# EAGLE design cardV3 (EAGLE 7.7.0)
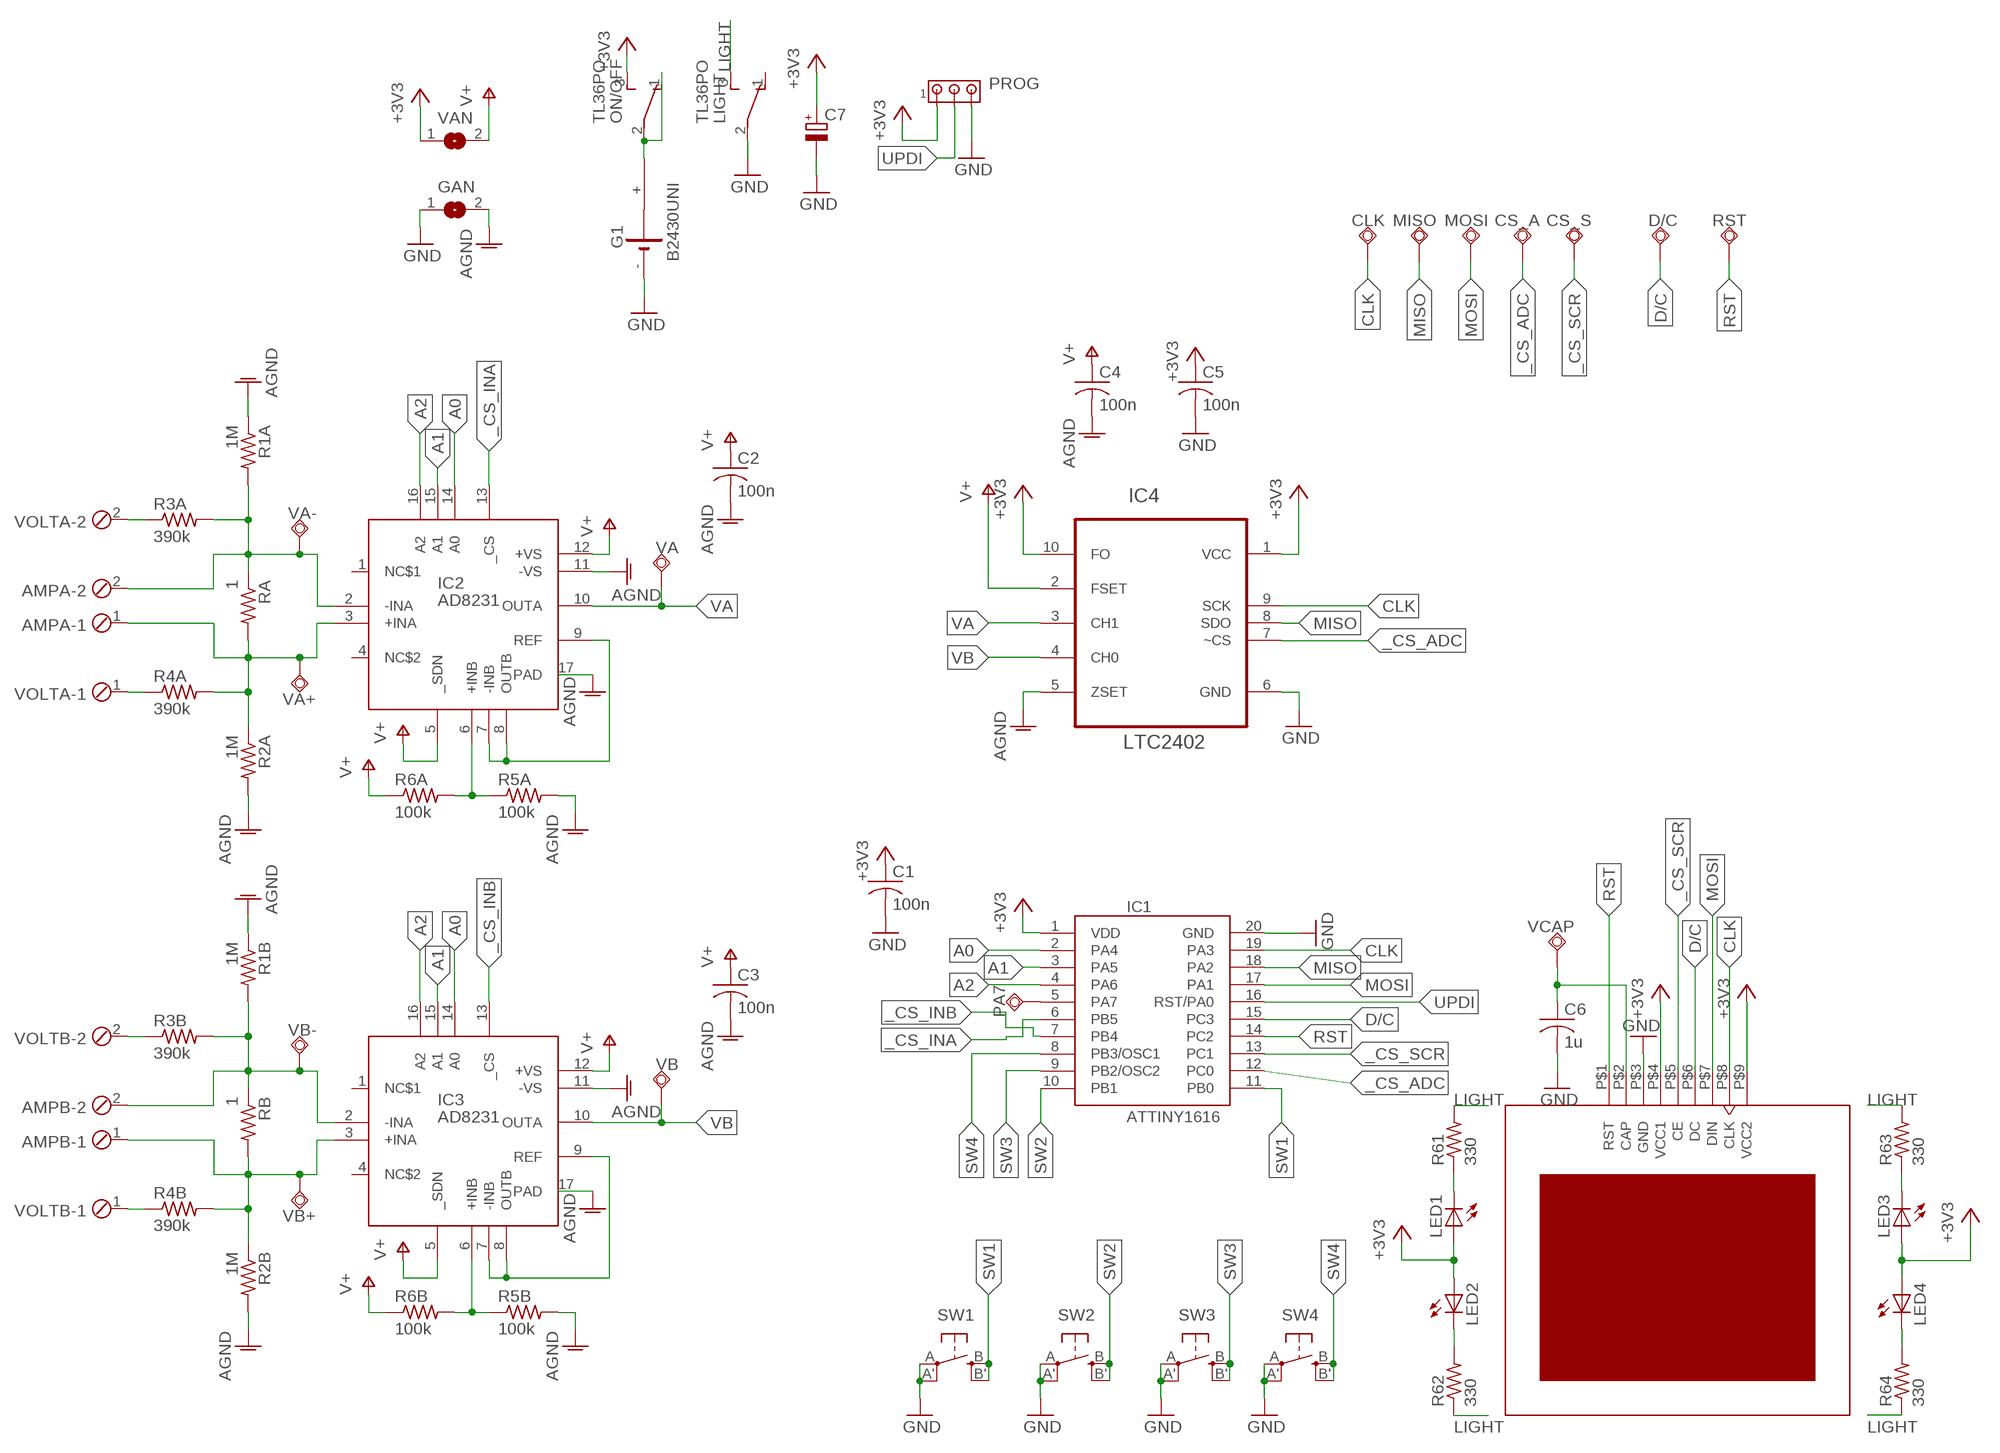
[diagram p0: schematic, sheet 1]

## Parts
AMPA  MPT2  [2POL254]
AMPB  MPT2  [2POL254]
C1  100n  C-USC0805K  [C0805K]
C2  100n  C-USC0805K  [C0805K]
C3  100n  C-USC0805K  [C0805K]
C4  100n  C-USC0805K  [C0805K]
C5  100n  C-USC0805K  [C0805K]
C6  1u  C-USC0805  [C0805]
C7  CPOL-EU153CLV-0405  [153CLV-0405]
CLK  TPSQB1,27  [B1,27]
CS_A  TPSQB1,27  [B1,27]
CS_S  TPSQB1,27  [B1,27]
D/C  TPSQB1,27  [B1,27]
G1  B2430UNI  [B2430UNI]
GAN  SJ  [SJ]
IC1  ATTINY1616  [SO20W]
IC2  AD8231  [LFCSP16]
IC3  AD8231  [LFCSP16]
IC4  LTC2402  LTC2402CMS  [MSOP10]
LED1  LEDCHIP-LED0805  [CHIP-LED0805]
LED2  LEDCHIP-LED0805  [CHIP-LED0805]
LED3  LEDCHIP-LED0805  [CHIP-LED0805]
LED4  LEDCHIP-LED0805  [CHIP-LED0805]
LIGHT  TL36PO  [TL3XPO]
MISO  TPSQB1,27  [B1,27]
MOSI  TPSQB1,27  [B1,27]
ON/OFF  TL36PO  [TL3XPO]
PA7  TPSQB1,27  [B1,27]
PROG  MTA03-100  [10X03MTA]
R1A  1M  R-US_M0805  [M0805]
R1B  1M  R-US_M0805  [M0805]
R2A  1M  R-US_M0805  [M0805]
R2B  1M  R-US_M0805  [M0805]
R3A  390k  R-US_M0805  [M0805]
R3B  390k  R-US_M0805  [M0805]
R4A  390k  R-US_M0805  [M0805]
R4B  390k  R-US_M0805  [M0805]
R5A  100k  R-US_M0805  [M0805]
R5B  100k  R-US_M0805  [M0805]
R6A  100k  R-US_M0805  [M0805]
R6B  100k  R-US_M0805  [M0805]
R61  330  R-US_M0805  [M0805]
R62  330  R-US_M0805  [M0805]
R63  330  R-US_M0805  [M0805]
R64  330  R-US_M0805  [M0805]
RA  1  R-US_M0805  [M0805]
RB  1  R-US_M0805  [M0805]
RST  TPSQB1,27  [B1,27]
SCR  NOKIA_SCREEN  [NOKIA_SCREEN]
SW1  SPST_TACT-EVQQ2  [EVQ-Q2]
SW2  SPST_TACT-EVQQ2  [EVQ-Q2]
SW3  SPST_TACT-EVQQ2  [EVQ-Q2]
SW4  SPST_TACT-EVQQ2  [EVQ-Q2]
VA  TPSQB1,27  [B1,27]
VA+  TPSQB1,27  [B1,27]
VA-  TPSQB1,27  [B1,27]
VAN  SJ  [SJ]
VB  TPSQB1,27  [B1,27]
VB+  TPSQB1,27  [B1,27]
VB-  TPSQB1,27  [B1,27]
VCAP  TPSQB1,27  [B1,27]
VOLTA  MPT2  [2POL254]
VOLTB  MPT2  [2POL254]

## Nets
+3V3: C1.1 C5.1 C7.+ IC1.1(VDD) IC4.1(VCC) IC4.10(FO) LED1.A LED2.A LED3.A LED4.A ON/OFF.3(S) PROG.1 SCR.P$4(VCC1) SCR.P$9(VCC2) VAN.1
_CS_ADC: CS_A.TP IC1.12(PC0) IC4.7(~CS)
_CS_INA: IC1.6(PB5) IC2.13(_CS)
_CS_INB: IC1.7(PB4) IC3.13(_CS)
_CS_SCR: CS_S.TP IC1.13(PC1) SCR.P$5(CE)
A0: IC1.2(PA4) IC2.14(A0) IC3.14(A0)
A1: IC1.3(PA5) IC2.15(A1) IC3.15(A1)
A2: IC1.4(PA6) IC2.16(A2) IC3.16(A2)
AGND: C2.2 C3.2 C4.2 GAN.2 IC2.11(-VS) IC2.17(PAD) IC3.11(-VS) IC3.17(PAD) IC4.5(ZSET) R1A.1 R1B.1 R2A.2 R2B.2 R5A.2 R5B.2
CLK: CLK.TP IC1.19(PA3) IC4.9(SCK) SCR.P$8(CLK)
D/C: D/C.TP IC1.15(PC3) SCR.P$6(DC)
GND: C1.2 C5.2 C6.2 C7.- G1.- GAN.1 IC1.20(GND) IC4.6(GND) LIGHT.2(P) PROG.3 SCR.P$3(GND) SW1.A'(P1) SW1.A(P) SW2.A'(P1) SW2.A(P) SW3.A'(P1) SW3.A(P) SW4.A'(P1) SW4.A(P)
LIGHT: LIGHT.3(S) R61.2 R62.1 R63.2 R64.1
MISO: IC1.18(PA2) IC4.8(SDO) MISO.TP
MOSI: IC1.17(PA1) MOSI.TP SCR.P$7(DIN)
N$1: G1.+ ON/OFF.1(O) ON/OFF.2(P)
N$2: LED1.C R61.1
N$3: C6.1 SCR.P$2(CAP) VCAP.TP
N$4: LED2.C R62.2
N$5: LED4.C R64.2
N$6: LED3.C R63.1
N$7: R4A.1 VOLTA.1
N$8: AMPB.2 IC3.2(-INA) R1B.2 R3B.2 RB.1 VB-.TP
N$9: AMPB.1 IC3.3(+INA) R2B.1 R4B.2 RB.2 VB+.TP
N$10: IC2.6(+INB) R5A.1 R6A.2
N$11: R3A.1 VOLTA.2
N$12: AMPA.2 IC2.2(-INA) R1A.2 R3A.2 RA.1 VA-.TP
N$13: IC2.7(-INB) IC2.8(OUTB) IC2.9(REF)
N$14: AMPA.1 IC2.3(+INA) R2A.1 R4A.2 RA.2 VA+.TP
N$15: R3B.1 VOLTB.2
N$16: IC3.7(-INB) IC3.8(OUTB) IC3.9(REF)
N$17: R4B.1 VOLTB.1
N$18: IC3.6(+INB) R5B.1 R6B.2
N$19: IC1.5(PA7) PA7.TP
RST: IC1.14(PC2) RST.TP SCR.P$1(RST)
SW1: IC1.11(PB0) SW1.B'(S1) SW1.B(S)
SW2: IC1.10(PB1) SW2.B'(S1) SW2.B(S)
SW3: IC1.9(PB2/OSC2) SW3.B'(S1) SW3.B(S)
SW4: IC1.8(PB3/OSC1) SW4.B'(S1) SW4.B(S)
UPDI: IC1.16(RST/PA0) PROG.2
V+: C2.1 C3.1 C4.1 IC2.5(_SDN) IC2.12(+VS) IC3.5(_SDN) IC3.12(+VS) IC4.2(FSET) R6A.1 R6B.1 VAN.2
VA: IC2.10(OUTA) IC4.3(CH1) VA.TP
VB: IC3.10(OUTA) IC4.4(CH0) VB.TP
Unconnected: G1.+@1(+) G1.+@2(+) G1.+@3(+) G1.+@4(+) G1.-@1(-) IC2.1(NC$1) IC2.4(NC$2) IC3.1(NC$1) IC3.4(NC$2) LIGHT.1(O)

## Library data of the parts
AMPA AMPB VOLTA VOLTB = con-phoenix-254:MPT2: PHOENIX CONNECTOR; OC_FARNELL: unknown; OC_NEWARK: unknown
C1-C5 = adafruit:C-US: CAPACITOR, American symbol
C6 = resistor:C-US: CAPACITOR, American symbol
C7 = rcl:CPOL-EU: POLARIZED CAPACITOR, European symbol
CLK CS_A CS_S D/C MISO MOSI PA7 RST VA VA+ VA- VB VB+ VB- VCAP = testpad:TPSQ: Test pad
G1 = battery:B2430UNI: LI BATTERY
GAN VAN = jumper:SJ: SMD solder JUMPER
IC1 = HomeMade:ATTINY1616
IC2 IC3 = HomeMade:AD8231: Digitally Programmable Instrumentation Amplifier Pin-programmable gain G = 1, 2, 4, 8, 16, 32, 64, or 128 Single-supply range: 3V to 5V Dual-supply range: ±1.5V to ±2.5V
IC4 = HomeMade:LTC2402CMS
LED1-LED4 = adafruit:LED: LED OSRAM: - CHIPLED LG R971, LG N971, LY N971, LG Q971, LY Q971, LO R971, LY R971 LH N974, LH R974 LS Q976, LO Q976, LY Q976 LO Q996 - Hyper CHIPLED LW Q18S LB Q993, LB Q99A, LB R99A - SideLED LS A670, LO A670, LY A670, LG A670, LP A670 LB A673, LV A673, LT A673, LW A673 LH A674 LY A675 LS A676, LA A676, LO A676, LY A676, LW A676 LS A679, LY A679, LG A679 - Hyper Micro SIDELED® LS Y876, LA Y876, LO Y876, LY Y876 LT Y87S - SmartLED LW L88C, LW L88S LB L89C, LB L89S, LG L890 LS L89K, LO L89K, LY L89K LS L896, LA L896, LO L896, LY L896 - TOPLED LS T670, LO T670, LY T670, LG T670, LP T670 LSG T670, LSP T670, LSY T670, LOP T670, LYG T670 LG T671, LOG T671, LSG T671 LB T673, LV T673, LT T673, LW T673 LH T674 LS T676, LA T676, LO T676, LY T676, LB T676, LH T676, LSB T676, LW T676 LB T67C, LV T67C, LT T67C, LS T67K, LO T67K, LY T67K, LW E67C LS E67B, LA E67B, LO E67B, LY E67B, LB E67C, LV E67C, LT E67C LW T67C LS T679, LY T679, LG T679 LS T770, LO T770, LY T770, LG T770, LP T770 LB T773, LV T773, LT T773, LW T773 LH T774 LS E675, LA E675, LY E675, LS T675 LS T776, LA T776, LO T776, LY T776, LB T776 LHGB T686 LT T68C, LB T68C - Hyper Mini TOPLED® LB M676 - Mini TOPLED Santana® LG M470 LS M47K, LO M47K, LY M47K Source: http://www.osram.convergy.de/
LIGHT ON/OFF = switch:TL36PO: TINY SWITCH ON - ON Source: http://www2.produktinfo.conrad.com/datenblaetter/700000-724999/705152-da-01-de-Subminiaturschalter_TL_36YO.pdf
PROG = con-amp:MTA03-100: AMP connector
R1A R1B R2A R2B R3A R3B R4A R4B R5A R5B R6A R6B R61-R64 RA RB = resistor:R-US_: RESISTOR, American symbol
SCR = HomeMade:NOKIA_SCREEN
SW1-SW4 = adafruit:SPST_TACT: SMT 6mm switch, EVQQ2 series http://www.ladyada.net/library/eagle

## Board
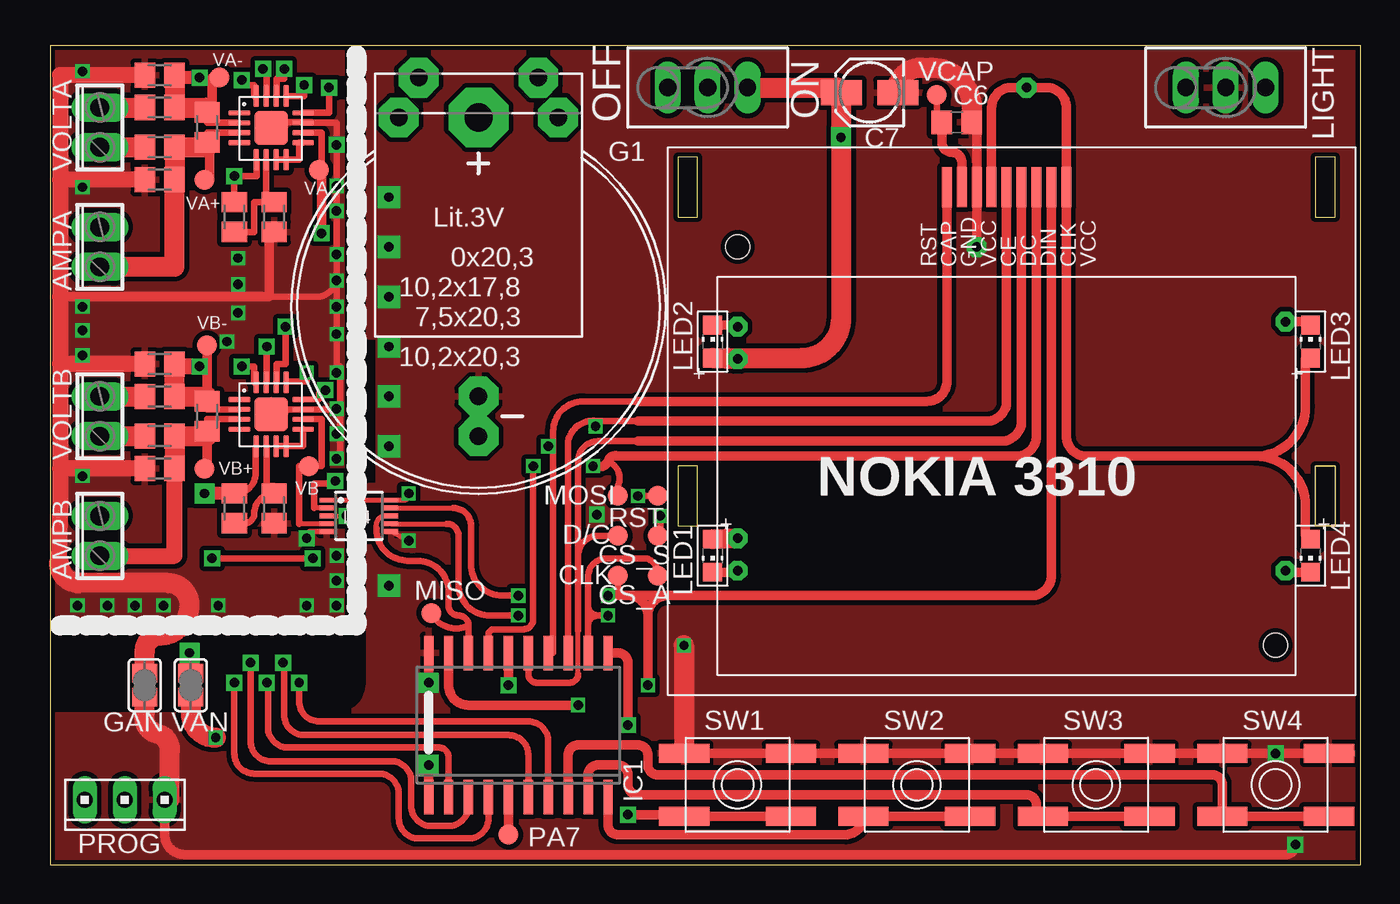
[diagram p1: board, top side]
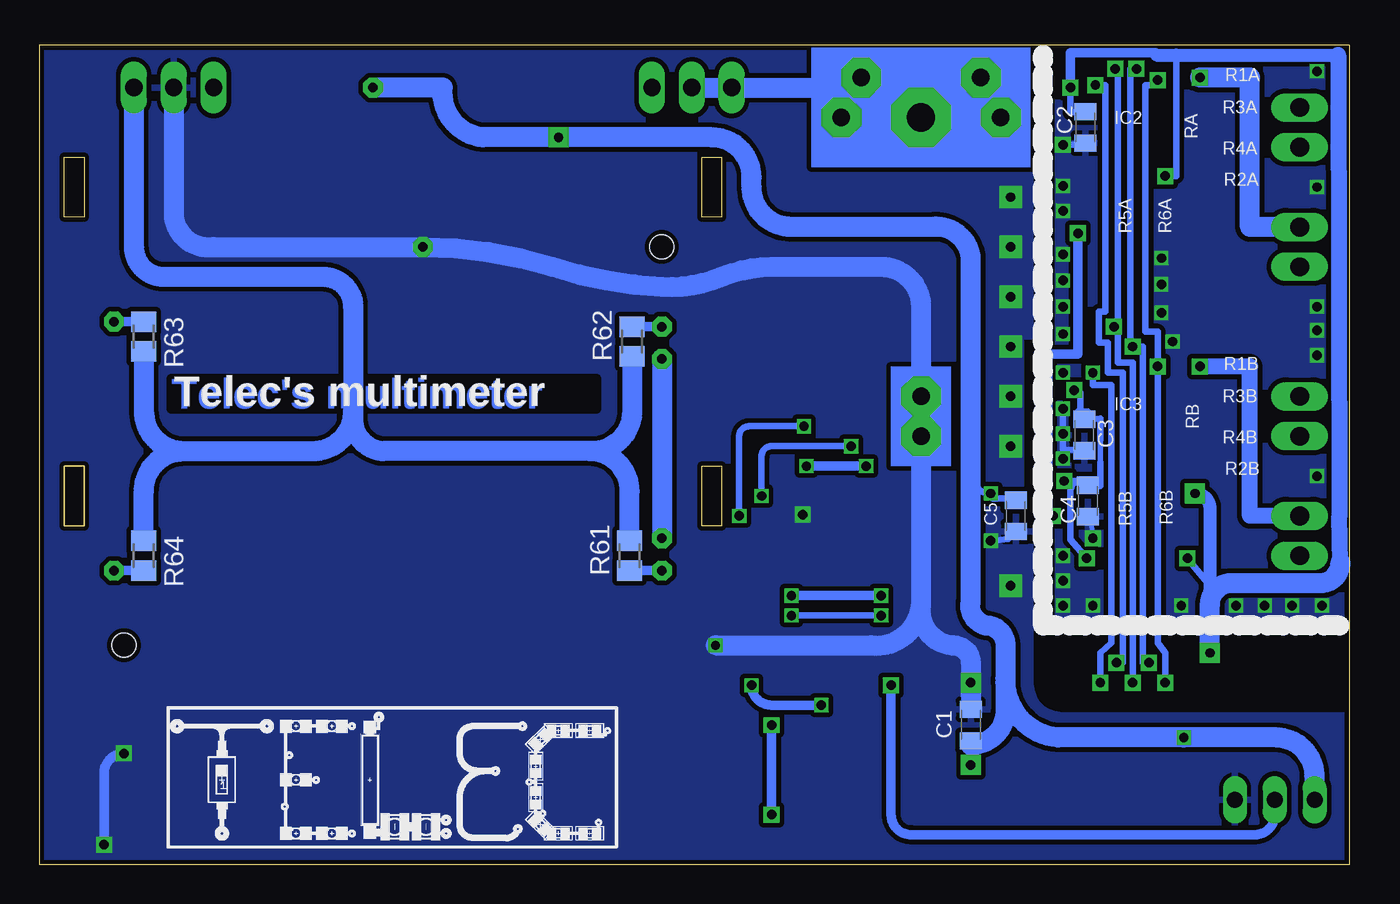
[diagram p2: board, bottom side, seen from below]

Size 83.5 x 52.23 mm. Coordinates in mm from the lower left corner, seen from the top.
Outline: 0,0 83.5,0 83.5,52.23 0,52.23 0,0
Copper layers (1*16): Top 0.035mm / dielectric 1.5mm / Bottom 0.035mm
Design rules "Cirly": minimum track width 6mil, minimum drill 0.3mm, track to track 6mil, track to pad 6mil, pad to pad 6mil, via to via 6mil, smd to smd 6mil, copper to edge 6mil, drill to drill 8mil, minimum pad ring 6mil, minimum via ring 6mil, stop-mask expansion 4mil, vias tented up to drill 0mil, thermal gap 10mil

### Footprints (pad centres in the part's own frame; a part is rotated, then mirrored left to right if it is on the bottom)
2POL254 = drill 1.2 long: 1 -1.27,0; 2 1.27,0
C0805K = smd 1.1 x 1.4: 1 -1,0; 2 1,0
C0805 = smd 1.3 x 1.5: 1 -0.95,0; 2 0.95,0
153CLV-0405 = smd 2.6 x 1.6: + 1.8,0; - -1.8,0
B1,27 = smd 1.27 x 1.27: TP 0,0
B2430UNI = drill 1.118 pad 2.54 octagon: + 3.81,14.605; +@1 -3.81,14.605; +@2 -5.08,12.065; +@3 5.08,12.065; - 0,-5.715; -@1 0,-8.255 | drill 1.803 pad 3.81 octagon: +@4 0,12.065
SJ = smd 1.168 x 1.6: 1 -0.762,0; 2 0.762,0
SO20W = smd 0.6 x 2.2: 1 -5.715,-4.6; 2 -4.445,-4.6; 3 -3.175,-4.6; 4 -1.905,-4.6; 5 -0.635,-4.6; 6 0.635,-4.6; 7 1.905,-4.6; 8 3.175,-4.6; 9 4.445,-4.6; 10 5.715,-4.6; 11 5.715,4.6; 12 4.445,4.6; 13 3.175,4.6; 14 1.905,4.6; 15 0.635,4.6; 16 -0.635,4.6; 17 -1.905,4.6; 18 -3.175,4.6; 19 -4.445,4.6; 20 -5.715,4.6
LFCSP16 = smd 1.397 x 0.356: 1 -1.905,1.079; 2 -1.905,0.445; 3 -1.905,-0.191; 4 -1.905,-0.826; 9 2.159,-0.826; 10 2.159,-0.191; 11 2.159,0.445; 12 2.159,1.079 | smd 0.356 x 1.397: 5 -0.826,-1.905; 6 -0.191,-1.905; 7 0.445,-1.905; 8 1.079,-1.905; 13 1.079,2.159; 14 0.445,2.159; 15 -0.191,2.159; 16 -0.826,2.159 | smd 2.159 x 2.159: 17 0.127,0.127
MSOP10 = smd 0.31 x 0.9: 1 -1,-2.05; 2 -0.5,-2.05; 3 0,-2.05; 4 0.5,-2.05; 5 1,-2.05; 6 1,2.05; 7 0.5,2.05; 8 0,2.05; 9 -0.5,2.05; 10 -1,2.05
CHIP-LED0805 = smd 1.2 x 1.2: A 0,-1.05; C 0,1.05
TL3XPO = drill 1.1 pad 1.422 long: 1 -2.54,0; 2 0,0; 3 2.54,0
10X03MTA = drill 1.016 long: 1 2.54,0; 2 0,0; 3 -2.54,0
M0805 = smd 1.3 x 1.6: 1 -0.95,0; 2 0.95,0
NOKIA_SCREEN = smd 0.635 x 2.54: P$1 17.78,32.385; P$2 18.733,32.385; P$3 19.685,32.385; P$4 20.637,32.385; P$5 21.59,32.385; P$6 22.543,32.385; P$7 23.495,32.385; P$8 24.448,32.385; P$9 25.4,32.385 | hole 1.524: 38.735,3.175; 4.445,28.575
EVQ-Q2 = smd 3.2 x 1.2: A -3.4,-2; A' 3.4,-2; B -3.4,2; B' 3.4,2

### Placement (x,y rotation side)
AMPA  3.17,39.37 90 top
AMPB  3.17,20.95 90 top
C1  24.13,8.89 90 bottom
C2  16.83,46.99 270 bottom
C3  16.91,27.38 270 bottom
C4  16.67,23.18 270 bottom
C5  21.27,22.23 270 bottom
C6  57.78,47.31 0 top
C7  52.23,49.21 180 top
CLK  36.2,18.41 0 top
CS_A  38.73,18.41 0 top
CS_S  38.73,20.95 0 top
D/C  36.2,20.95 0 top
G1  27.3,35.56 0 top
GAN  6.03,11.43 90 top
IC1  29.84,8.89 0 top
IC2  13.97,46.83 0 top
IC3  13.97,28.57 0 top
IC4  19.68,22.23 270 top
LED1  42.23,19.68 180 top
LED2  42.23,33.34 0 top
LED3  80.33,33.34 0 top
LED4  80.33,19.68 180 top
LIGHT  74.93,49.53 0 top
MISO  24.29,16.03 0 top
MOSI  36.2,23.5 0 top
ON/OFF  41.91,49.53 0 top
PA7  29.21,1.91 90 top
PROG  4.76,4.13 180 top
R1A  6.99,50.32 0 top
R1B  6.99,31.91 0 top
R2A  6.99,43.66 180 top
R2B  6.99,25.24 180 top
R3A  6.99,48.26 0 top
R3B  6.99,29.84 0 top
R4A  6.99,45.72 0 top
R4B  6.99,27.3 0 top
R5A  14.29,41.27 270 top
R5B  14.29,22.7 270 top
R6A  11.75,41.27 270 top
R6B  11.75,22.7 270 top
R61  45.88,19.68 90 bottom
R62  45.72,33.34 90 bottom
R63  76.83,33.66 270 bottom
R64  76.83,19.68 270 bottom
RA  10,46.99 270 top
RB  10,28.57 270 top
RST  38.73,23.5 0 top
SCR  39.37,10.79 0 top
SW1  43.81,5.08 180 top
SW2  55.24,5.08 180 top
SW3  66.67,5.08 180 top
SW4  78.11,5.08 180 top
VA  17.14,44.29 0 top
VA+  9.84,43.66 180 top
VA-  10.79,50.16 0 top
VAN  8.97,11.43 90 top
VB  16.51,25.4 90 top
VB+  9.84,25.24 180 top
VB-  10,33.1 0 top
VCAP  56.52,49.05 0 top
VOLTA  3.17,46.99 90 top
VOLTB  3.17,28.57 90 top

### Tracks (layer width: path | path; a pad name or v marks a point on that pad's centre or on a via)
+3V3  (via drill 0.6, 0.6 pad 1.27)
  Top 0.305: IC4.1 IC4.10 22.59,23.23 arc90 v22.86,23.65
  Top 0.61: 76.83,26.04 66.04,26.04 arc-90 64.77,27.3 SCR.P$9 64.77,48.26 arc90 63.5,49.53 v62.23,49.53 61.28,49.53 arc90 60.01,48.26 SCR.P$4 | IC1.1 v24.13,6.35 | 76.83,26.04 arc-90 80.01,22.86 80.01,21.05 arc90 LED4.A | 76.83,26.04 arc90 80.01,29.21 80.01,32.23 arc90 80.33,32.54 LED3.A
  Top 1.27: LED2.A v43.81,32.23 | v43.81,20.8 LED1.A | LED2.A 43.18,32.29 | VAN.1 8.97,9.6 arc90 v10.56,8.1 | ON/OFF.3 50.11,49.53 arc-90 C7.+ 50.43,46.35 | v50.4,46.35 50.43,46.35 | LED2.A 47.89,32.29 arc90 50.43,34.83 50.43,46.35
  Bottom 0.406: C5.1 arc-90 21.38,23.34 22.7,23.34 arc90 v22.86,23.65 23.02,23.65 arc90 23.81,24.45 23.81,27.94 24.13,24.13
  Bottom 0.61: v24.13,6.35 24.13,7.62 C1.1
  Bottom 1.27: v62.23,49.53 57.78,49.53 arc-90 55.24,46.35 v50.4,46.35 40.64,46.35 arc90 38.1,43.81 38.1,43.18 arc-90 35.56,40.64 26.67,40.64 arc90 24.13,38.73 24.13,24.13 24.13,16.83 arc-90 23.18,15.24 arc90 21.91,13.97 21.91,12.06 | v43.81,32.23 v43.81,20.8 | 24.13,7.62 arc-90 21.91,9.84 21.91,12.06 | PROG.1 2.22,5.56 arc-90 4.6,8.1 v10.56,8.1 18.57,8.1 arc90 21.91,12.06
_CS_ADC  (via drill 0.6)
  Top 0.305: IC4.7 25.27,21.73
  Top 0.406: IC1.12 34.29,15.24 | 34.29,15.24 34.29,15.88 | 34.29,16.51 34.29,18.26 arc-90 35.4,19.53 37.94,19.53 arc-90 38.73,18.26 CS_A.TP | 25.27,21.73 arc-90 26.04,20.95 26.04,17.88 arc90 28.04,15.88 v29.84,15.88 | v35.56,15.88 34.92,15.88 | 34.92,15.88 arc-90 34.29,16.51 | 34.29,16.51 34.29,15.88 | 34.29,15.88 34.92,15.88 | 34.92,15.88 arc90 34.29,15.24
  Bottom 0.406: v29.84,15.88 v35.56,15.88
_CS_INA  (via drill 0.6 pad 1.02)
  Top 0.406: IC2.13 16.19,48.99 v16.19,49.69 | v14.84,12.86 arc-90 14.92,12.78 14.92,9.53 arc90 16.19,8.26 29.21,8.26 arc-90 30.48,6.99 IC1.6
  Bottom 0.406: v16.19,49.69 15.56,49.69 15.56,35.24 15.95,35.24 15.95,33.26 15.4,33.26 15.4,31.35 14.45,31.35 14.45,12.86 v14.84,12.86
_CS_INB  (via drill 0.6 pad 0.81, 0.6 pad 1.02)
  Top 0.406: IC3.13 15.08,30.73 15.08,30.8 16.35,30.8 v16.35,31.35 | v15.88,11.59 15.88,10.4 arc90 17.14,9.13 30.48,9.13 arc-90 31.75,7.86 IC1.7
  Bottom 0.406: v16.35,31.35 16.35,30.56 15.16,30.56 15.16,14.13 15.88,13.49 v15.88,11.59
_CS_SCR  (via drill 0.6)
  Top 0.406: 37.47,28.26 34.92,28.26 | 34.92,28.26 arc90 33.02,26.99 IC1.13 | 38.42,20.95 CS_S.TP arc90 38.89,21.11 v38.89,22.23 | v34.77,27.94 34.92,28.26
  Top 0.61: 37.47,28.26 59.69,28.26 arc90 60.96,29.53 SCR.P$5
  Bottom 0.406: v38.89,22.23 38.89,27.3 arc90 38.26,27.94 v34.77,27.94
A0  (via drill 0.6 pad 1.02)
  Top 0.406: IC2.14 14.45,48.99 14.45,50.09 14.92,50.09 v14.92,50.72 | IC3.14 14.45,30.73 14.45,31.91 15,31.91 v15,34.29 | IC1.2 25.4,6.83 arc90 24.77,7.46 15.16,7.46 arc-90 13.89,8.73 13.89,11.59 v13.81,11.59
  Bottom 0.406: v14.92,50.72 14.76,50.72 14.76,34.29 | v15,34.29 14.76,34.29 | 14.76,34.29 14.76,31.99 13.81,31.99 v13.81,11.59
A1  (via drill 0.6 pad 1.02)
  Top 0.406: IC2.15 13.81,48.99 13.81,50.72 v13.57,50.72 | IC3.15 13.81,30.73 v13.81,33.02 | IC1.3 26.67,3.73 arc-90 25.4,2.46 24.29,2.46 arc-90 23.02,3.73 23.02,5.32 arc90 21.75,6.59 14.05,6.59 arc-90 12.78,7.86 v12.78,12.86
  Bottom 0.406: v13.57,50.72 13.97,50.72 13.97,33.02 v13.81,33.02 13.18,33.02 13.18,12.86 v12.78,12.86
A2  (via drill 0.6 pad 1.02)
  Top 0.406: IC2.16 13.02,48.99 13.02,49.69 12.22,49.69 v12.22,50.01 | IC3.16 13.02,30.73 13.02,31.75 v12.22,31.75 | IC1.4 27.94,2.94 arc-90 26.67,1.67 23.5,1.67 arc-90 22.23,2.94 22.23,4.52 arc90 20.95,5.79 13.02,5.79 arc-90 11.75,7.06 v11.75,11.59
  Bottom 0.406: v12.22,50.01 12.22,49.69 13.02,49.69 13.02,33.97 12.22,33.97 v12.22,31.75 12.22,14.13 11.75,13.49 v11.75,11.59
AGND  (via drill 0.6 pad 0.61, 0.6 pad 1.02)
  Top 0.305: v16.35,20.8 16.51,21.23 IC4.5
  Top 0.406: IC2.11 16.67,47.28 | 16.67,47.28 18.26,47.28 v18.26,45.88 v18.26,43.26 | IC2.17 14.61,46.96 14.61,46.99 14.76,46.99 14.76,47.31 16.67,47.31 16.67,47.28 | IC3.17 14.1,29.02 IC3.11 18.26,29.02 v18.26,29.05 | v18.26,43.26 18.26,37.47 arc-90 16.99,36.2 13.97,36.2 | v18.26,43.26 18.26,31.91 arc90 18.49,31.75 18.49,25.8 arc-90 v18.26,25.88
  Top 0.61: R5A.2 13.97,40.33 13.97,36.2 0.64,36.2
  Top 1.016: R1A.1 0.64,50.32 0.64,43.66 | 0.64,43.66 0.64,36.2 0.64,31.91 | 0.64,31.91 0.64,25.24 | 0.64,25.24 0.64,22.23 0.58,19.23 | R2A.2 0.64,43.66 | R1B.1 0.64,31.91 | R2B.2 0.64,25.24
  Top 1.27: GAN.2 6.03,13.57 arc-90 6.99,14.61 arc90 8.89,16.51 arc90 7.54,17.94 1.85,17.94 arc-91 0.58,19.23
  Bottom 0.305: C4.2 16.51,22.18 v16.35,20.8
  Bottom 0.406: v18.26,45.88 16.83,45.88 C2.2 | C3.2 18.26,26.46 v18.26,29.05
  other vias: 18.26,41.67 18.26,38.89 18.26,37.23 18.26,33.81 18.26,31.35 18.26,27.46 18.26,18.1 18.26,16.51 16.35,16.51 10.72,16.51 5.4,16.51 3.65,16.51 1.75,16.51 7.22,16.51 18.26,19.68 2.06,24.77 2.06,32.46 2.06,34.05 2.06,35.56 2.06,43.18 2.06,50.56 11.99,38.66 11.99,36.99 11.99,35.16 11.27,33.34 18.26,35.56
  pour Bottom (isolate 0.305): 0,52.07 18.57,52.07 18.57,15.88 0,15.88
  pour Top (isolate 0.305): 0,52.07 18.57,52.07 18.57,15.88 0,15.88
CLK  (via drill 0.6)
  Top 0.305: IC4.9 25.69,22.73
  Top 0.406: CLK.TP 36.2,17.78 arc90 36.83,17.14 | 25.69,22.73 arc-90 26.83,21.59 26.83,19.14 arc90 28.83,17.14 v29.84,17.14
  Top 0.61: v35.56,17.14 36.83,17.14 | 36.83,17.14 39.37,17.14 | 39.37,17.14 62.55,17.14 arc90 63.82,18.41 SCR.P$8 | IC1.19 25.4,11.43 arc90 26.67,10.16 v33.66,10.16 | v38.1,11.43 38.1,15.88 | 38.1,15.88 arc-90 39.37,17.14 | 38.1,15.88 arc90 36.83,17.14
  Bottom 0.61: v35.56,17.14 v29.84,17.14 | v33.66,10.16 36.83,10.16 arc90 v38.1,11.43
D/C
  Top 0.33: 33.66,12.14 33.66,14.92
  Top 0.406: IC1.15 30.48,12.14 arc90 31.04,11.59 33.1,11.59 arc90 33.66,12.14 | 33.66,14.92 33.66,19.68 | 33.66,19.68 33.66,25.72 arc-90 34.92,26.99 37.47,26.99 | D/C.TP 34.92,20.95 arc90 33.66,19.68
  Top 0.61: 37.47,26.99 60.64,26.99 arc90 61.91,28.26 SCR.P$6
GND  (via drill 0.6, 0.6 pad 1.02, 0.6 pad 1.27, 0.6 pad 1.42)
  Top 0.305: IC4.6 v22.86,20.64
  Top 0.61: v59.05,39.37 SCR.P$3 59.05,47.31 C6.2 | SW3.A' SW3.A SW4.A' v78.11,7.08 SW4.A | SW3.A' 62.87,7.08 62.87,6.99 63.27,6.99 SW3.A' | SW3.A' SW2.A SW2.A' SW1.A SW1.A' | v24.13,11.59 IC1.20 | 7.3,3.97 7.3,1.91 arc90 8.57,0.64 78.74,0.64 arc90 v79.38,1.27
  Top 1.27: v40.4,13.97 40.41,11.43 SW1.A' | 7.62,4.13 7.62,7.14 arc90 6.83,8.33 arc-90 6.03,9.68 GAN.1 | C7.- arc-90 53.98,49.27 arc-90 55.51,50.8 56.2,50.8 arc-90 58.73,48.26 C6.2
  Bottom 0.406: v22.86,20.64 21.75,20.75 arc90 C5.2
  Bottom 0.61: C1.2 24.13,10.16 | 24.13,10.79 v24.13,11.59 | v79.38,1.27 79.38,5.81 arc90 v78.11,7.08
  Bottom 1.27: LIGHT.2 74.93,41.27 arc-90 72.39,39.37 v59.05,39.37 arc17 50.8,38.1 arc-14 43.81,36.83 arc-25 40.01,37.47 arc21 36.83,38.1 29.84,38.1 arc90 27.3,35.56 G1.- 27.3,16.51 | 24.13,10.16 24.13,10.79 24.13,12.86 arc-90 25.25,13.97 25.4,13.97 arc90 27.3,16.51 | v40.4,13.97 30.48,13.97 arc-90 27.3,16.51
  other vias: 21.59,42.55 21.59,39.37 21.59,36.2 21.59,26.67 21.59,33.02 21.59,29.84 21.59,17.78 34.85,22.3
  pour Top (isolate 0.305): 0,9.53 0,0 83.5,0 83.5,52.07 20.32,52.23 20.32,33.66 20.95,33.66 20.95,24.13 20.32,24.13 20.32,11.53 arc-90 18.32,9.53
  pour Bottom (isolate 0.305): 83.5,0 83.5,52.07 20.32,52.23 20.32,33.66 20.95,33.66 20.95,24.13 20.32,24.13 20.32,11.53 arc-90 18.32,9.53 0,9.53 0,0
LIGHT
  Bottom 1.27: R63.2 76.83,28.89 arc-90 74.3,26.35 | R64.1 76.83,23.81 arc90 74.3,26.35 | R62.1 45.72,28.89 arc90 48.26,26.35 48.42,26.35 | R61.2 45.88,23.81 arc-90 48.42,26.35 | LIGHT.3 77.47,39.37 arc-90 75.56,37.47 65.41,37.47 arc90 63.5,35.56 63.5,28.89 | 63.5,28.89 63.5,28.57 arc-90 61.59,26.35 48.42,26.35 | 74.3,26.35 66.04,26.35 arc-90 63.5,28.89
MISO
  Top 0.305: IC4.8 21.27,22.23 arc90 20.8,21.43
  Top 0.406: 20.8,21.43 20.8,21.37 arc90 22.8,19.37 23.4,19.37 arc-90 25.4,17.37 25.4,16.51 arc90 26.04,15.88 arc-90 26.67,15.24 | 26.67,15.24 IC1.18 | 26.67,15.24 arc-90 MISO.TP
MOSI  (via drill 0.6)
  Top 0.406: IC1.17 27.94,14.61 arc-90 28.26,15 30.16,15 arc90 30.8,15.64 v30.8,25.4 | MOSI.TP 36.2,24.13 arc90 35.56,25.72
  Top 0.61: v34.61,25.4 34.92,25.4 arc90 35.56,25.72 arc-90 36.2,26.04 61.59,26.04 arc90 62.87,27.3 SCR.P$7
  Bottom 0.61: v30.8,25.4 v34.61,25.4
N$1
  Bottom 1.27: ON/OFF.2 ON/OFF.1 30.48,49.53 G1.+
N$2  (via drill 0.6 pad 1.27)
  Top 0.61: LED1.C 43.81,18.64 v43.81,18.73
  Bottom 0.61: v43.81,18.73 45.4,18.73 R61.1
N$3
  Top 0.406: C6.1 arc-90 56.52,46.99 VCAP.TP
  Top 0.61: SCR.P$2 58.1,44.77 arc90 57.47,45.4 arc-90 56.84,46.03 C6.1
N$4  (via drill 0.6 pad 1.27)
  Top 0.61: LED2.C 43.5,34.39 v43.81,34.29
  Bottom 0.61: v43.81,34.29 45.4,34.29 R62.2
N$5  (via drill 0.6 pad 1.27)
  Top 0.61: LED4.C 79.06,18.64 v78.74,18.73
  Bottom 0.61: v78.74,18.73 77.47,18.73 R64.2
N$6  (via drill 0.6 pad 1.27)
  Top 0.61: v78.74,34.61 80.33,34.61 LED3.C
  Bottom 0.61: R63.1 79.06,34.6 v78.74,34.61
N$7
  Top 1.27: VOLTA.1 R4A.1
N$8  (via drill 0.6 pad 1.02)
  Top 0.406: IC3.2 10,29.02 RB.1
  Top 0.61: VB-.TP RB.1
  Top 1.016: v9.53,31.75 7.93,31.75 R1B.2
  Top 1.27: R1B.2 R3B.2 10,29.84 RB.1
  Bottom 1.016: AMPB.2 6.35,22.23 6.35,31.75 v9.53,31.75
N$9
  Top 0.406: IC3.3 10,28.38 RB.2
  Top 0.61: VB+.TP 10,25.24 RB.2
  Top 1.016: AMPB.1 7.93,19.68 R2B.1
  Top 1.27: R2B.1 R4B.2 10,27.3 RB.2
N$10
  Top 0.406: R5A.1 13.78,42.23 | 13.78,42.23 IC2.6 | R6A.2 13.02,40.33 13.02,42.23 13.78,42.23
N$11
  Top 1.27: VOLTA.2 R3A.1
N$12  (via drill 0.6 pad 1.02)
  Top 0.406: IC2.2 10,47.28 RA.1
  Top 0.61: VA-.TP 10.32,50.16 10.32,48.1 RA.1
  Top 0.813: v9.53,50.16 7.93,50.16 R1A.2
  Top 1.27: RA.1 10,48.26 R3A.2 R1A.2
  Bottom 1.27: AMPA.2 6.35,40.64 6.35,50.16 v9.53,50.16
N$13
  Top 0.406: IC2.9 15.88,46.01 15.88,44.93 IC2.8 IC2.7
N$14
  Top 0.406: IC2.3 10,46.64 RA.2
  Top 0.61: VA+.TP 10.16,43.66 10.16,45.72 RA.2
  Top 1.27: RA.2 10,45.72 R4A.2 R2A.1 7.93,38.1 AMPA.1
N$15
  Top 1.27: VOLTB.2 R3B.1
N$16
  Top 0.406: IC3.9 16.13,26.67 IC3.8 IC3.7
N$17
  Top 1.27: VOLTB.1 R4B.1
N$18
  Top 0.406: R6B.2 12.38,21.75 arc90 13.02,22.38 arc-90 R5B.1 14.29,24.13 13.81,24.13 13.81,26.67 IC3.6
N$19
  Top 0.61: IC1.5 PA7.TP
RST  (via drill 0.6)
  Top 0.406: IC1.14 32.07,13.49 32.07,26.67 | 32.07,26.67 32.07,27.62 arc-90 33.97,29.53 37.47,29.53 | RST.TP v37.47,23.5 | v31.75,26.67 32.07,26.67
  Top 0.61: 37.47,29.53 55.88,29.53 arc90 57.15,30.8 SCR.P$1
  Bottom 0.406: v37.47,23.5 37.47,26.04 arc90 36.83,26.67 v31.75,26.67
SW1  (via drill 0.6 pad 1.02)
  Top 0.61: SW1.B SW1.B' arc90 40.32,3.17 v36.83,3.17 | IC1.11 36.2,13.49 arc-90 36.83,12.86 v36.83,8.89
  Bottom 0.61: v36.83,8.89 v36.83,3.17
SW2
  Top 0.61: SW2.B SW2.B' arc-90 50.67,1.91 36.2,1.91 arc-90 35.56,2.54 IC1.10 35.56,3.81 | SW2.B 59.05,3.08 59.05,3.17 58.65,3.17 SW2.B
SW3
  Top 0.61: SW3.B SW3.B' 62.87,3.08 62.87,3.81 arc90 62.23,4.45 37.47,4.45 arc-90 36.83,5.08 36.83,5.71 arc90 36.2,6.35 34.92,6.35 arc90 34.29,5.71 IC1.9
SW4
  Top 0.61: SW4.B SW4.B' 74.7,5.08 arc90 74.07,5.71 38.73,5.71 arc-90 38.1,6.35 38.1,6.99 arc90 37.47,7.62 33.66,7.62 arc90 33.02,6.99 IC1.8
UPDI  (via drill 0.6 pad 1.02)
  Top 0.61: IC1.16 v29.21,11.43
  Bottom 0.61: v29.21,11.43 29.21,3.17 arc-90 27.94,1.91 6.03,1.91 arc-90 4.76,3.17 PROG.2
V+  (via drill 0.6 pad 1.02, 0.6 pad 1.27)
  Top 0.305: IC4.2 16.83,22.73
  Top 0.406: v17.78,49.53 17.78,47.91 IC2.12 | IC3.12 17.14,29.69 17.14,30.05 v17.54,30.24 | 16.83,22.73 16.83,24.29 18.26,24.29 v18.18,24.45 | R6A.1 v11.75,43.89 13.18,43.89 13.18,44.93 IC2.5 | IC3.5 arc90 13.1,26.62 13.1,24.92 arc-90 11.83,23.65 R6B.1 | v16.75,19.53 v10.32,19.53
  Top 0.813: R6B.1 v9.85,23.65 arc-90 v9.84,23.65
  Top 1.27: VAN.2 8.89,12.19 v8.89,13.49
  Bottom 0.356: 15.88,27.07 15.88,25.48
  Bottom 0.406: v17.78,49.53 17.78,47.94 16.83,47.94 C2.1 | v17.54,30.24 17.14,30.08 17.14,28.89 | 17.14,28.89 17.3,28.89 | 17.14,28.89 16.67,28.89 C3.1 15.88,28.42 15.88,27.07 | v18.18,24.45 17.14,24.45 | v11.75,43.89 11.03,43.89 11.03,51.59 | 17.14,24.45 16.67,24.45 C4.1 15.88,24.13 15.88,25.48 15.88,25.64 | 17.14,24.45 arc-90 17.78,23.81 17.78,20.72 v16.75,19.53 | v10.32,19.53 8.89,17.78
  Bottom 0.61: 12.3,51.59 12.46,51.67 12.38,51.75 17.78,51.75 v17.78,49.53
  Bottom 0.813: 12.3,51.59 11.03,51.59 0.71,51.59 | v9.84,23.65 arc90 8.89,22.7 8.89,17.78 8.89,16.55
  Bottom 1.016: 0.71,51.59 0.64,22.23 0.58,19.23
  Bottom 1.27: v8.89,13.49 8.89,16.55 arc90 7.58,17.94 1.85,17.94 arc-91 0.58,19.23
VA  (via drill 0.6 pad 1.02)
  Top 0.305: IC4.3 v18.89,22.23
  Top 0.406: IC2.10 17.3,46.64 17.3,44.45 | 17.3,44.45 17.3,43.97 | VA.TP arc-90 17.3,44.45
  Top 0.61: 17.3,43.97 v17.3,40.24
  Bottom 0.406: v18.89,22.23 19.21,22.23 19.21,24.92
  Bottom 0.61: 19.21,24.92 19.21,32.54 17.3,32.54 v17.3,40.24
VB
  Top 0.305: IC4.4 15.88,21.73
  Top 0.406: IC3.10 17.3,28.38 17.3,25.4 VB.TP 15.88,25.4 15.88,21.73
(copper drawn outside any net)
  shapes: Bottom area x2

### Text on the board
Bottom: Telec's multimeter
tPlace: ON | OFF | LIGHT
bNames: Telec's multimeter | F:/Users/Loup/Doc/eagle/Logo/logoBW.bmp
bValues: Max volt: | Max amp: